# EAGLE design platine (EAGLE 9.4.0)
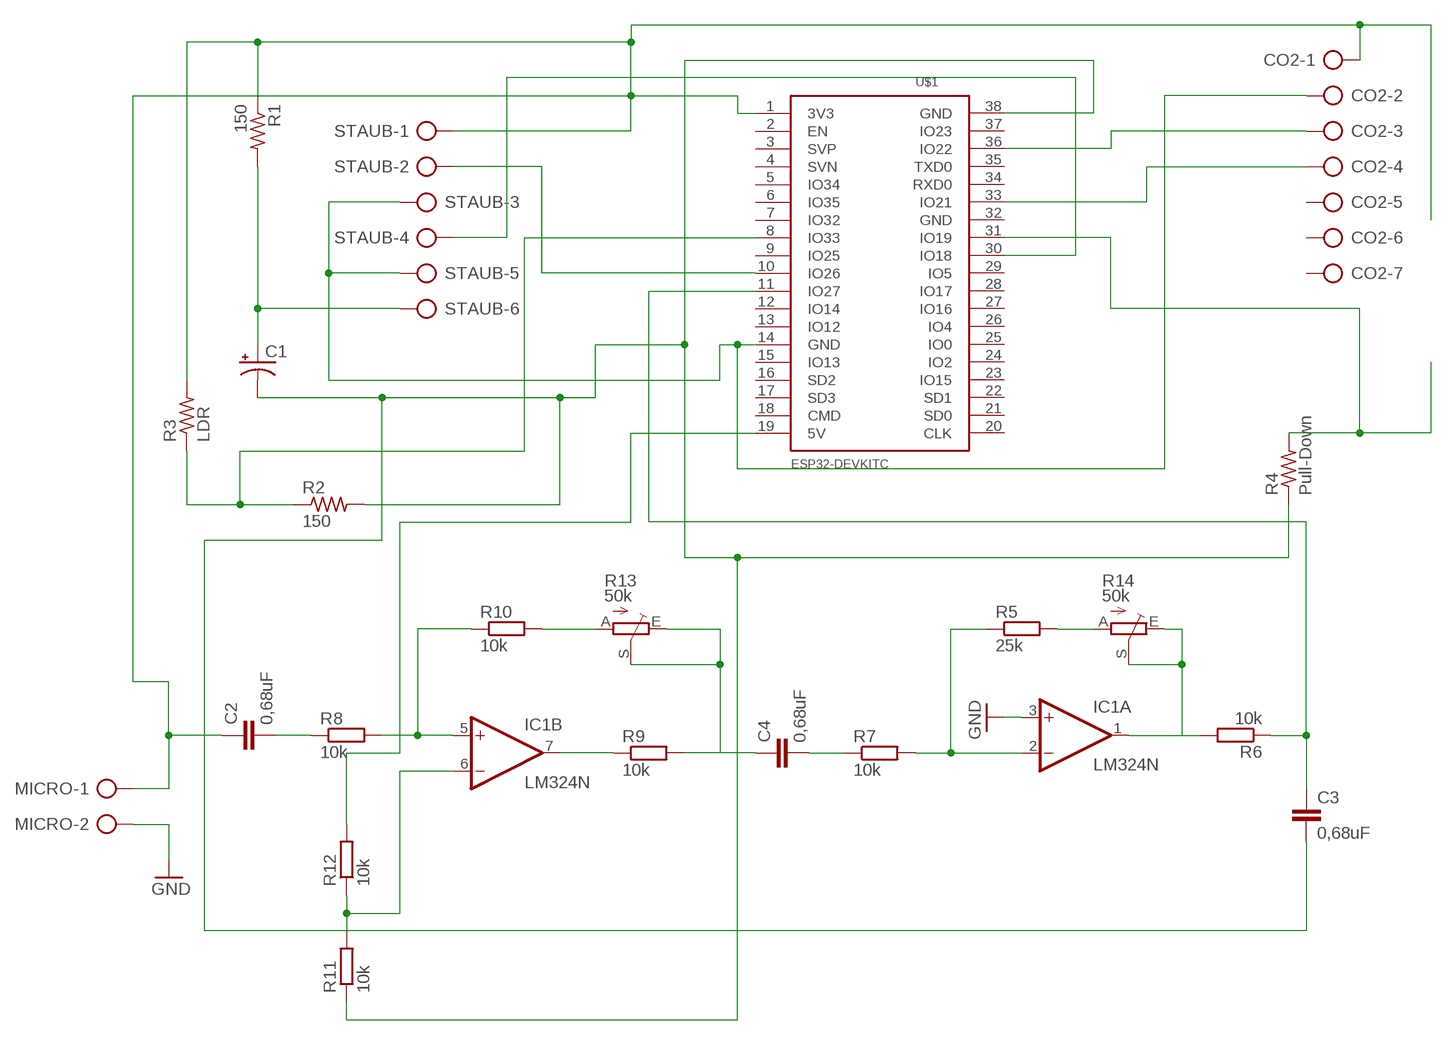
[diagram p0: schematic, sheet 1]

## Parts
C1  CPOL-USE2,5-6E  [E2,5-6E]
C2  0,68uF  C-EU025-025X050  [C025-025X050]
C3  0,68uF  C-EU025-025X050  [C025-025X050]
C4  0,68uF  C-EU025-025X050  [C025-025X050]
CO2  AK300/7  [AK300/7]
IC1  LM324N  [DIL14]
MICRO  AK300/2  [AK300/2]
R1  150  R-US_0207/10  [0207/10]
R2  150  R-US_0207/10  [0207/10]
R3  LDR  R-US_V234/12  [V234/12]
R4  Pull-Down  R-US_0207/10  [0207/10]
R5  25k  R-EU_0204/7  [0204/7]
R6  10k  R-EU_0204/7  [0204/7]
R7  10k  R-EU_0204/7  [0204/7]
R8  10k  R-EU_0204/7  [0204/7]
R9  10k  R-EU_0204/7  [0204/7]
R10  10k  R-EU_0204/7  [0204/7]
R11  10k  R-EU_0204/7  [0204/7]
R12  10k  R-EU_0204/7  [0204/7]
R13  50k  TRIM_EU-LI10  [LI10]
R14  50k  TRIM_EU-LI10  [LI10]
STAUB  AK300/6  [AK300/6]
U$1  ESP32DEVKITC  [ESP32-DEVKITC]

## Nets
GND: IC1.3(A:+IN) MICRO.2
N$1: STAUB.2 U$1.10(IO26)
N$2: C1.+ R1.2 STAUB.6
N$3: R12.2 U$1.19(5V)
N$4: STAUB.4 U$1.30(IO18)
N$5: CO2.3 U$1.36(IO22)
N$6: CO2.4 U$1.33(IO21)
N$7: R2.1 R3.1 U$1.8(IO33)
N$8: R4.2 U$1.31(IO19)
N$9: C2.1 CO2.1 MICRO.1 R1.1 R3.2 STAUB.1 U$1.1(3V3)
N$10: C3.1 R6.1 U$1.11(IO27)
N$11: R10.2 R13.A
N$12: C4.1 R9.2 R13.E R13.S
N$13: IC1.7(B:OUT) R9.1
N$14: IC1.5(B:+IN) R8.2 R10.1
N$15: C2.2 R8.1
N$16: IC1.6(B:-IN) R11.2 R12.1
N$17: C4.2 R7.1
N$18: IC1.2(A:-IN) R5.1 R7.2
N$19: IC1.1(A:OUT) R6.2 R14.E R14.S
N$20: R5.2 R14.A
N$21: C1.- C3.2 R2.2 R4.1 R11.1 U$1.38(GND)
N$23: CO2.2 STAUB.3 STAUB.5 U$1.14(GND)
Unconnected: CO2.5 CO2.6 CO2.7 IC1.8(C:OUT) IC1.9(C:-IN) IC1.10(C:+IN) IC1.12(D:+IN) IC1.13(D:-IN) IC1.14(D:OUT) U$1.2(EN) U$1.3(SVP) U$1.4(SVN) U$1.5(IO34) U$1.6(IO35) U$1.7(IO32) U$1.9(IO25) U$1.12(IO14) U$1.13(IO12) U$1.15(IO13) U$1.16(SD2) U$1.17(SD3) U$1.18(CMD) U$1.20(CLK) U$1.21(SD0) U$1.22(SD1) U$1.23(IO15) U$1.24(IO2) U$1.25(IO0) U$1.26(IO4) U$1.27(IO16) U$1.28(IO17) U$1.29(IO5) U$1.32(GND) U$1.34(RXD0) U$1.35(TXD0) U$1.37(IO23)

## Power pins joined to a net without a drawn wire
V+: IC1.4(P:V+)
V-: IC1.11(P:V-)

## Library data of the parts
C1 = adafruit:CPOL-US: POLARIZED CAPACITOR, American symbol
C2-C4 = resistor:C-EU: CAPACITOR, European symbol
CO2 = con-ptr500:AK300/7: CONNECTOR; OC_FARNELL: unknown; OC_NEWARK: unknown
IC1 = linear:LM324: OP AMP
MICRO = con-ptr500:AK300/2: CONNECTOR; OC_FARNELL: unknown; OC_NEWARK: unknown
R1-R4 = adafruit:R-US_: RESISTOR, American symbol
R5-R12 = rcl:R-EU_: RESISTOR, European symbol
R13 R14 = pot:TRIM_EU-: POTENTIOMETER
STAUB = con-ptr500:AK300/6: CONNECTOR; OC_FARNELL: unknown; OC_NEWARK: unknown
U$1 = ESP32-DEVKITC_rightone:ESP32DEVKITC

## Board
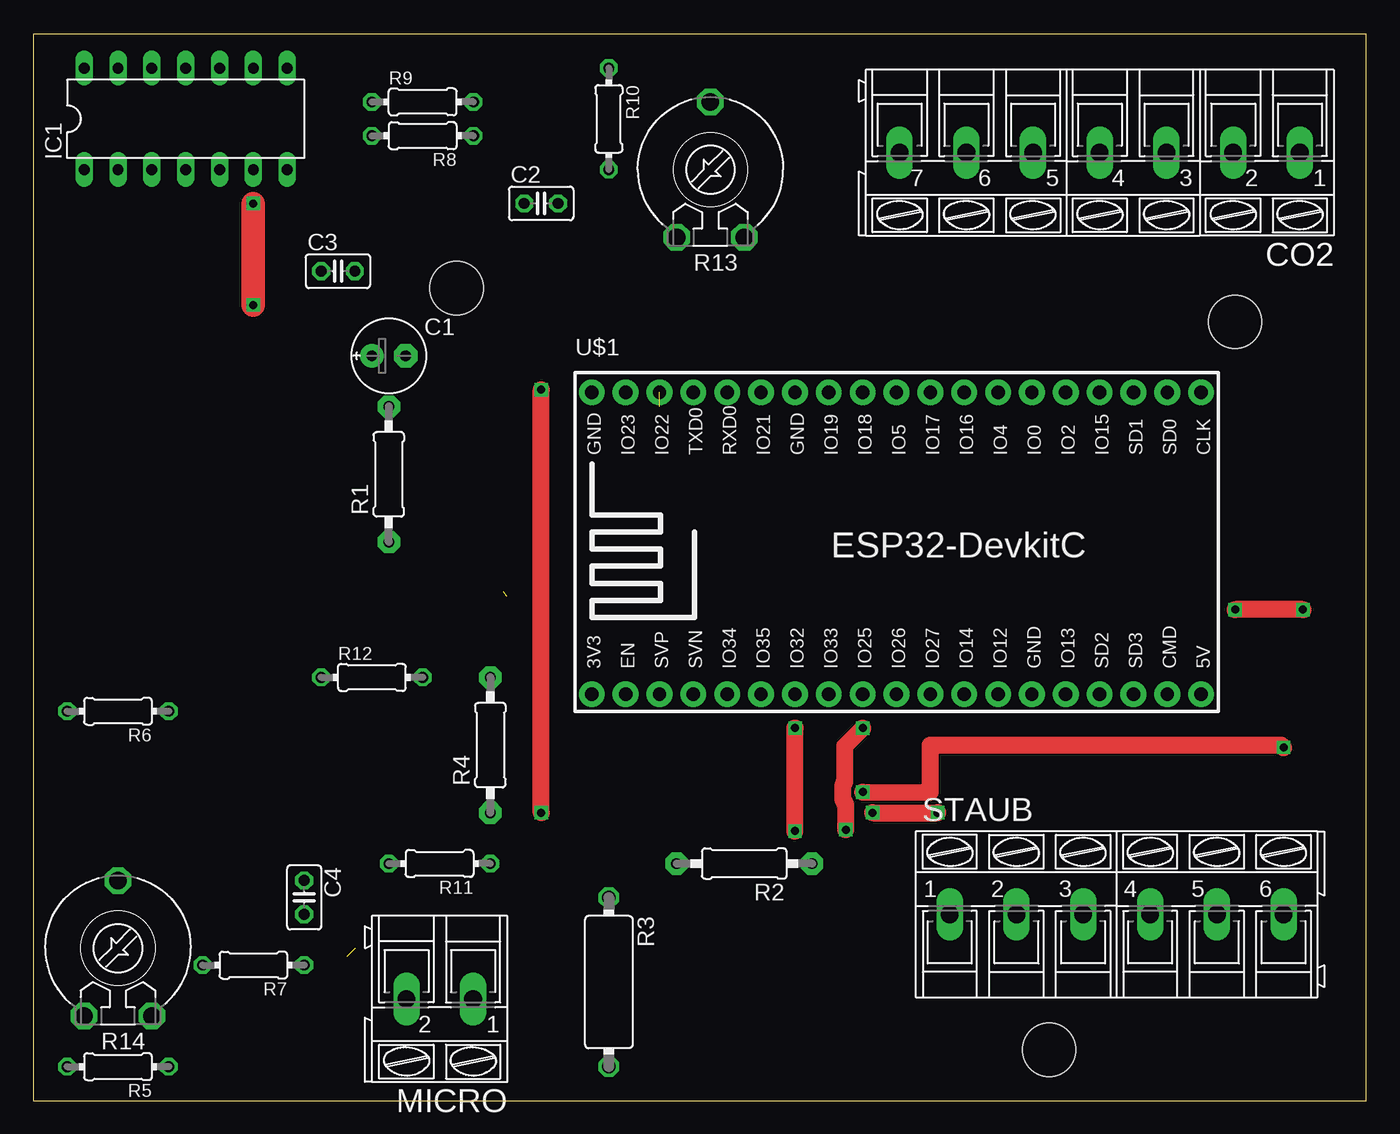
[diagram p1: board, top side]
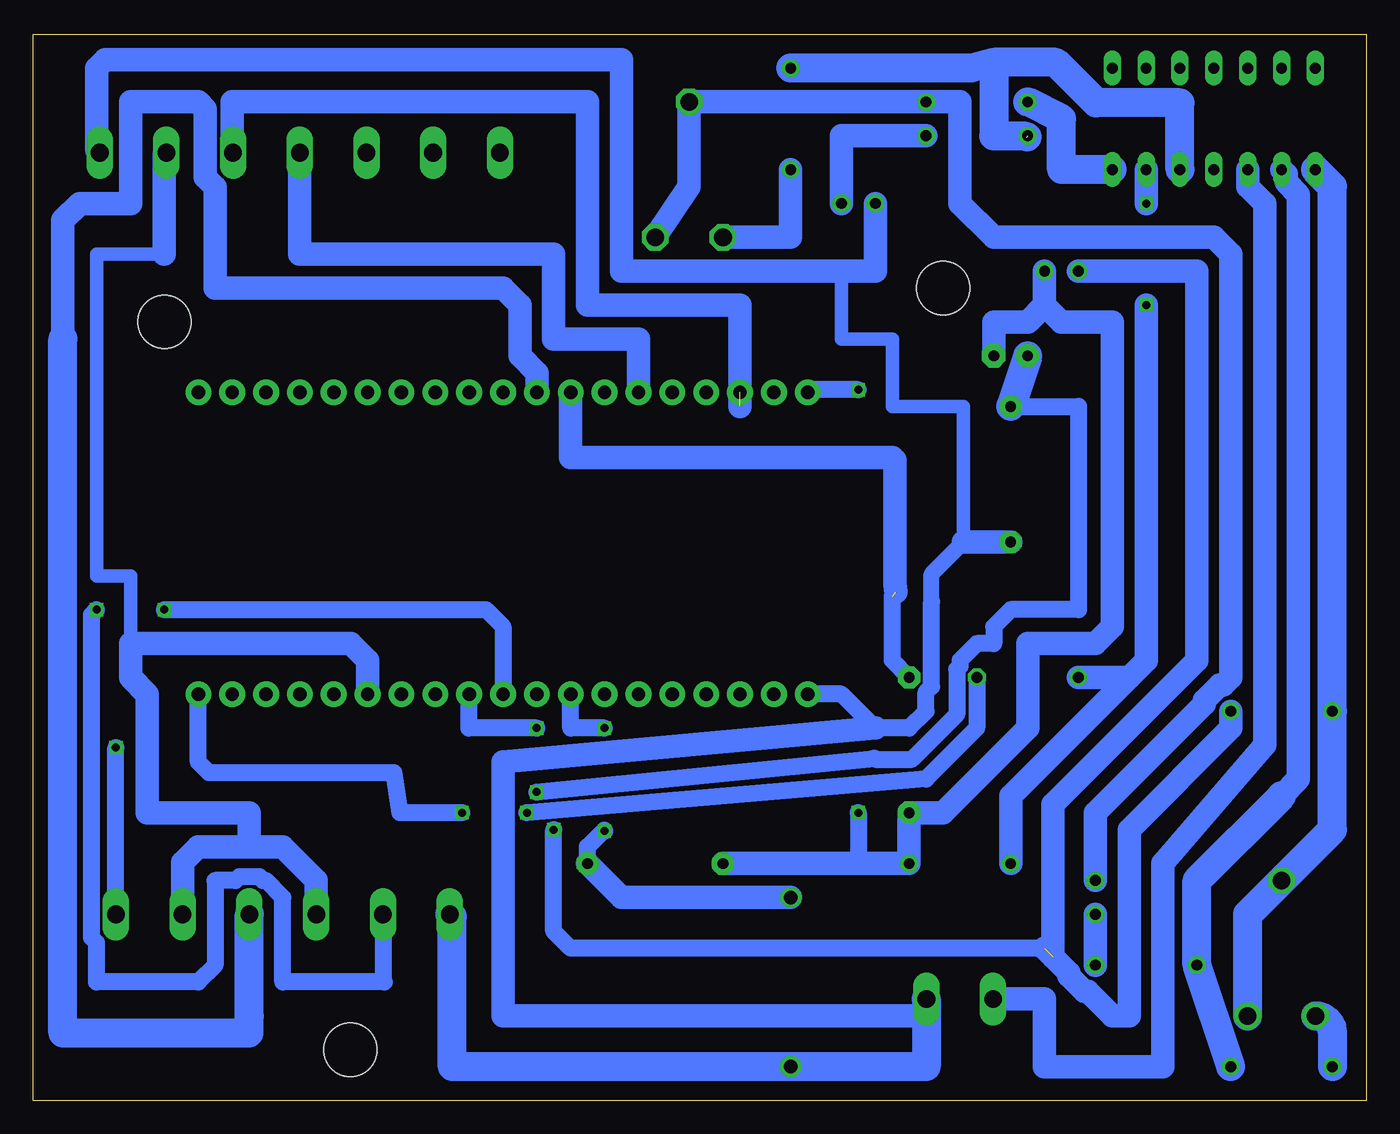
[diagram p2: board, bottom side, seen from below]

Size 100 x 80 mm. Coordinates in mm from the lower left corner, seen from the top.
Outline: 0,0 100,0 100,80 0,80 0,0
Copper layers (1*16): Top 0.035mm / dielectric 1.5mm / Bottom 0.035mm
Design rules "default": minimum track width 10mil, minimum drill 24mil, track to track 8mil, track to pad 8mil, pad to pad 8mil, via to via 8mil, smd to smd 8mil, copper to edge 40mil, drill to drill 8mil, minimum pad ring 10mil, minimum via ring 8mil, stop-mask expansion 4mil, vias tented up to drill 0mil, thermal gap 10mil
Holes 4 mm at 76.2,3.81 31.75,60.96 90.17,58.42

### Footprints (pad centres in the part's own frame; a part is rotated, then mirrored left to right if it is on the bottom)
E2,5-6E = drill 0.813 pad 1.778: + -1.27,0 | drill 0.813 pad 1.778 octagon: - 1.27,0
C025-025X050 = drill 0.813 octagon: 1 -1.27,0; 2 1.27,0
AK300/7 = drill 1.321 long: 1 -15.011,0; 2 -10.008,0; 3 -5.004,0; 4 0,0; 5 5.004,0; 6 10.008,0; 7 15.011,0
DIL14 = drill 0.813 long: 1 -7.62,-3.81; 2 -5.08,-3.81; 3 -2.54,-3.81; 4 0,-3.81; 5 2.54,-3.81; 6 5.08,-3.81; 7 7.62,-3.81; 8 7.62,3.81; 9 5.08,3.81; 10 2.54,3.81; 11 0,3.81; 12 -2.54,3.81; 13 -5.08,3.81; 14 -7.62,3.81
AK300/2 = drill 1.321 long: 1 -2.515,0; 2 2.489,0
0207/10 = drill 0.813 pad 1.676 octagon: 1 -5.08,0; 2 5.08,0
V234/12 = drill 1.016 octagon: 1 -6.35,0; 2 6.35,0
0204/7 = drill 0.813 octagon: 1 -3.81,0; 2 3.81,0
LI10 = drill 1.321 octagon: A -2.54,-5.08; E 2.54,-5.08; S 0,5.08
AK300/6 = drill 1.321 long: 1 -12.522,0; 2 -7.518,0; 3 -2.515,0; 4 2.515,0; 5 7.518,0; 6 12.522,0
ESP32-DEVKITC = drill 1 pad 1.93: 1 -22.87,-11.42; 2 -20.33,-11.42; 3 -17.79,-11.42; 4 -15.25,-11.42; 5 -12.71,-11.42; 6 -10.17,-11.42; 7 -7.63,-11.42; 8 -5.09,-11.42; 9 -2.55,-11.42; 10 -0.01,-11.42; 11 2.53,-11.42; 12 5.07,-11.42; 13 7.61,-11.42; 14 10.15,-11.42; 15 12.69,-11.42; 16 15.23,-11.42; 17 17.77,-11.42; 18 20.31,-11.42; 19 22.85,-11.42; 20 22.85,11.23; 21 20.31,11.23; 22 17.77,11.23; 23 15.23,11.23; 24 12.69,11.23; 25 10.15,11.23; 26 7.61,11.23; 27 5.07,11.23; 28 2.53,11.23; 29 -0.01,11.23; 30 -2.55,11.23; 31 -5.09,11.23; 32 -7.63,11.23; 33 -10.17,11.23; 34 -12.71,11.23; 35 -15.25,11.23; 36 -17.79,11.23; 37 -20.33,11.23; 38 -22.87,11.23

### Placement (x,y rotation side)
C1  26.67,55.88 0 top
C2  38.1,67.31 0 top
C3  22.86,62.23 0 top
C4  20.32,15.24 270 top
CO2  80.01,71.12 180 top
IC1  11.43,73.66 0 top
MICRO  30.48,7.62 180 top
R1  26.67,46.99 90 top
R2  53.34,17.78 180 top
R3  43.18,8.89 270 top
R4  34.29,26.67 90 top
R5  6.35,2.54 180 top
R6  6.35,29.21 180 top
R7  16.51,10.16 180 top
R8  29.21,72.39 180 top
R9  29.21,74.93 0 top
R10  43.18,73.66 270 top
R11  30.48,17.78 180 top
R12  25.4,31.75 0 top
R13  50.8,69.85 0 top
R14  6.35,11.43 0 top
STAUB  81.28,13.97 0 top
U$1  64.77,41.91 0 top

### Tracks (layer width: path | path; a pad name or v marks a point on that pad's centre or on a via)
GND
  Bottom 1.778: IC1.3 8.89,68.58 7.62,67.31 7.62,26.67 15.24,17.78 15.24,2.54 24.13,2.54 24.13,7.62 MICRO.2
N$1  (via drill 0.6)
  Top 1.27: v95.25,36.83 v90.17,36.83
  Bottom 1.27: STAUB.2 73.76,8.99 73.66,8.89 81.28,8.89 81.28,15.24 82.55,16.51 82.76,16.51 83.04,16.79 84.55,16.79 84.83,16.51 86.36,16.51 86.36,10.16 87.63,8.89 95.25,8.89 95.25,11.84 95.63,12.22 95.63,36.45 v95.25,36.83 | v90.17,36.83 66.04,36.83 64.77,35.56 U$1.10
N$2  (via drill 0.6)
  Top 1.27: v62.23,23.14 67.3,23.13 67.3,26.66 67.31,26.67 93.62,26.67 v93.8,26.49
  Bottom 1.27: R1.2 21.59,52.07 21.59,36.83 26.67,36.83 27.94,35.56 27.94,34.29 29.21,34.29 30.48,33.02 30.48,32.6 30.71,32.37 30.71,28.98 34.09,25.6 36.83,25.6 36.91,25.68 v62.23,23.14 | STAUB.6 v93.8,26.49
  Bottom 2.184: C1.+ R1.2
N$3  (via drill 0.6)
  Top 1.27: v62.97,21.59 v67.84,21.59
  Bottom 1.27: R12.2 29.21,27.94 33.02,24.13 v62.97,21.59 | v67.84,21.59 72.49,21.59 72.94,24.59 86.82,24.59 87.63,25.4 U$1.19
N$4
  Bottom 1.778: 97.79,57.15 97.79,66.04 96.52,67.31 92.71,67.31 92.71,74.93 87.63,74.93 87.1,74.4 87.1,69.27 86.36,68.53 86.36,60.96 64.77,60.96 63.5,59.69 63.5,55.88 62.22,54.6 U$1.30
  Bottom 2.184: 97.79,57.15 97.79,5.08 83.82,5.08 83.82,6.35 83.8,6.35 STAUB.4
N$5  (1 unrouted)
  Bottom 1.778: CO2.3 85.09,71.2 85.09,74.93 58.42,74.93 58.42,59.69 46.99,59.69 46.99,52.07
N$6
  Bottom 1.778: CO2.4 80.01,63.5 60.96,63.5 60.96,57.15 54.61,57.15 U$1.33
N$7  (via drill 0.6)
  Top 1.27: v57.14,20.23 v57.14,27.93 v57.15,27.94
  Bottom 1.27: R2.1 58.42,19.03 57.15,20.3 v57.15,20.24 v57.14,20.23 | v57.15,27.94 59.69,27.94 U$1.8
  Bottom 1.778: R3.1 55.88,15.24 R2.1
N$8  (1 unrouted)
  Bottom 1.27: R4.2 35.56,33.02 35.56,37.83
  Bottom 1.778: 35.29,38.17 35.35,38.71 35.35,48.05 35.56,48.26 59.69,48.26 U$1.31
N$9
  Bottom 1.016: 30.21,41.91 30.21,52.07 35.56,52.07 35.56,57.15 39.37,57.15 39.37,62.23
  Bottom 1.2: 32.61,37.42 32.61,39.51 30.21,41.91
  Bottom 1.27: U$1.1 39.38,30.49 36.83,27.94 34.29,27.94 33.02,29.21 33.02,30.65 32.61,31.06 32.61,37.42
  Bottom 1.778: CO2.1 95.25,71.35 95.25,77.47 94.62,78.09 55.88,78.09 | 55.88,78.09 | 55.88,78.09 55.88,62.23 39.37,62.23 36.83,62.23 C2.1 | 30.21,41.91 R1.1 | 36.83,27.94 64.77,25.4 64.77,6.35 32.99,6.35
  Bottom 2.184: MICRO.1 32.99,6.35 32.99,2.56 33.02,2.54 R3.2 68.58,2.54 68.58,13.79 STAUB.1
N$10  (via drill 0.6)  (1 unrouted)
  Top 1.27: v60.96,20.32 60.96,22.22 60.89,22.29 60.89,22.4 60.76,22.53 60.76,23.75 60.89,23.88 60.89,26.6 v62.23,27.94
  Bottom 1.27: 24.13,11.43 59.69,11.43 60.96,12.7 v60.96,20.32 | U$1.11 67.31,27.94 v62.23,27.94
  Bottom 1.778: 24.13,11.43 22.3,9.6 22.3,9.34 21.14,8.18 20.88,8.18 19.05,6.35 17.78,6.35 17.78,20.32 10.16,27.94 R6.1 | 23.5,10.79 23.5,22.23 12.7,33.02 12.7,62.23 C3.1
N$11
  Bottom 1.778: R10.2 43.18,64.77 R13.A
N$12
  Bottom 1.778: R13.E 50.8,68.58 R13.S R9.2 30.48,74.93 30.48,67.31 27.94,64.77 11.43,64.77 10.16,63.5 10.16,31.75 10.72,31.19 10.98,31.19 12.14,30.03 12.14,29.77 20.32,21.59 C4.1
N$13
  Bottom 2.184: IC1.7 22.86,69.85 22.86,73.66 R9.1
N$14  (1 unrouted)
  Bottom 2.184: IC1.5 13.97,74.85 20.24,74.85 23.28,77.89 27.94,77.89 | 27.94,77.89 27.94,72.39 25.66,72.39 25.45,72.29 | 27.94,77.89 29.63,77.47 R10.1
N$15
  Bottom 1.778: R8.1 39.37,72.39 C2.2
N$16  (via drill 0.6)
  Top 1.778: v16.51,59.69 v16.51,67.31
  Bottom 1.778: R11.2 26.67,22.86 17.78,31.75 | 17.78,31.75 16.51,33.02 v16.51,59.69 | IC1.6 v16.51,67.31 | 17.78,31.75 R12.1
N$17
  Bottom 1.778: R7.1 C4.2
N$18
  Bottom 1.778: 6.35,22.86 5.08,24.13 5.08,67.98 5.99,68.89 5.99,69.49 IC1.2
  Bottom 2.184: R5.1 R7.2 12.7,16.51 6.35,22.86
N$19
  Bottom 2.184: R14.E 8.89,13.97 R14.S 2.54,20.32 R6.2 2.54,68.58 IC1.1
N$20
  Bottom 2.184: R14.A arc90 2.54,5.08 R5.2
N$21  (via drill 0.6)
  Top 1.27: v38.1,21.59 v38.1,53.34
  Bottom 1.27: v38.1,53.34 41.7,53.34 U$1.38 | v38.1,21.59 38.1,17.78
  Bottom 1.778: R2.2 38.1,17.78 R11.1 R4.1 31.75,21.59 25.4,27.94 25.4,34.29 20.32,34.29 19.05,35.56 19.05,58.42 22.86,58.42 24.13,59.69 | C3.2 24.13,59.69 | 24.13,59.69 25.4,58.42 27.94,58.42 C1.-
N$23
  Bottom 1.016: 90.17,63.5 95.25,63.5 95.25,39.37 92.71,39.37 92.71,34.29
  Bottom 1.778: STAUB.5 88.8,17.88 87.63,19.05 83.82,19.05 | 83.82,19.05 81.28,19.05 78.77,16.54 STAUB.3 | 83.82,19.05 83.82,21.59 91.44,21.59 91.44,30.48 92.71,31.75 92.71,34.29 76.2,34.29 74.93,33.02 U$1.14 | 90.17,63.5 90.17,70.97 CO2.2